# EAGLE design cm3-adaptor-board (EAGLE 9.5.2)
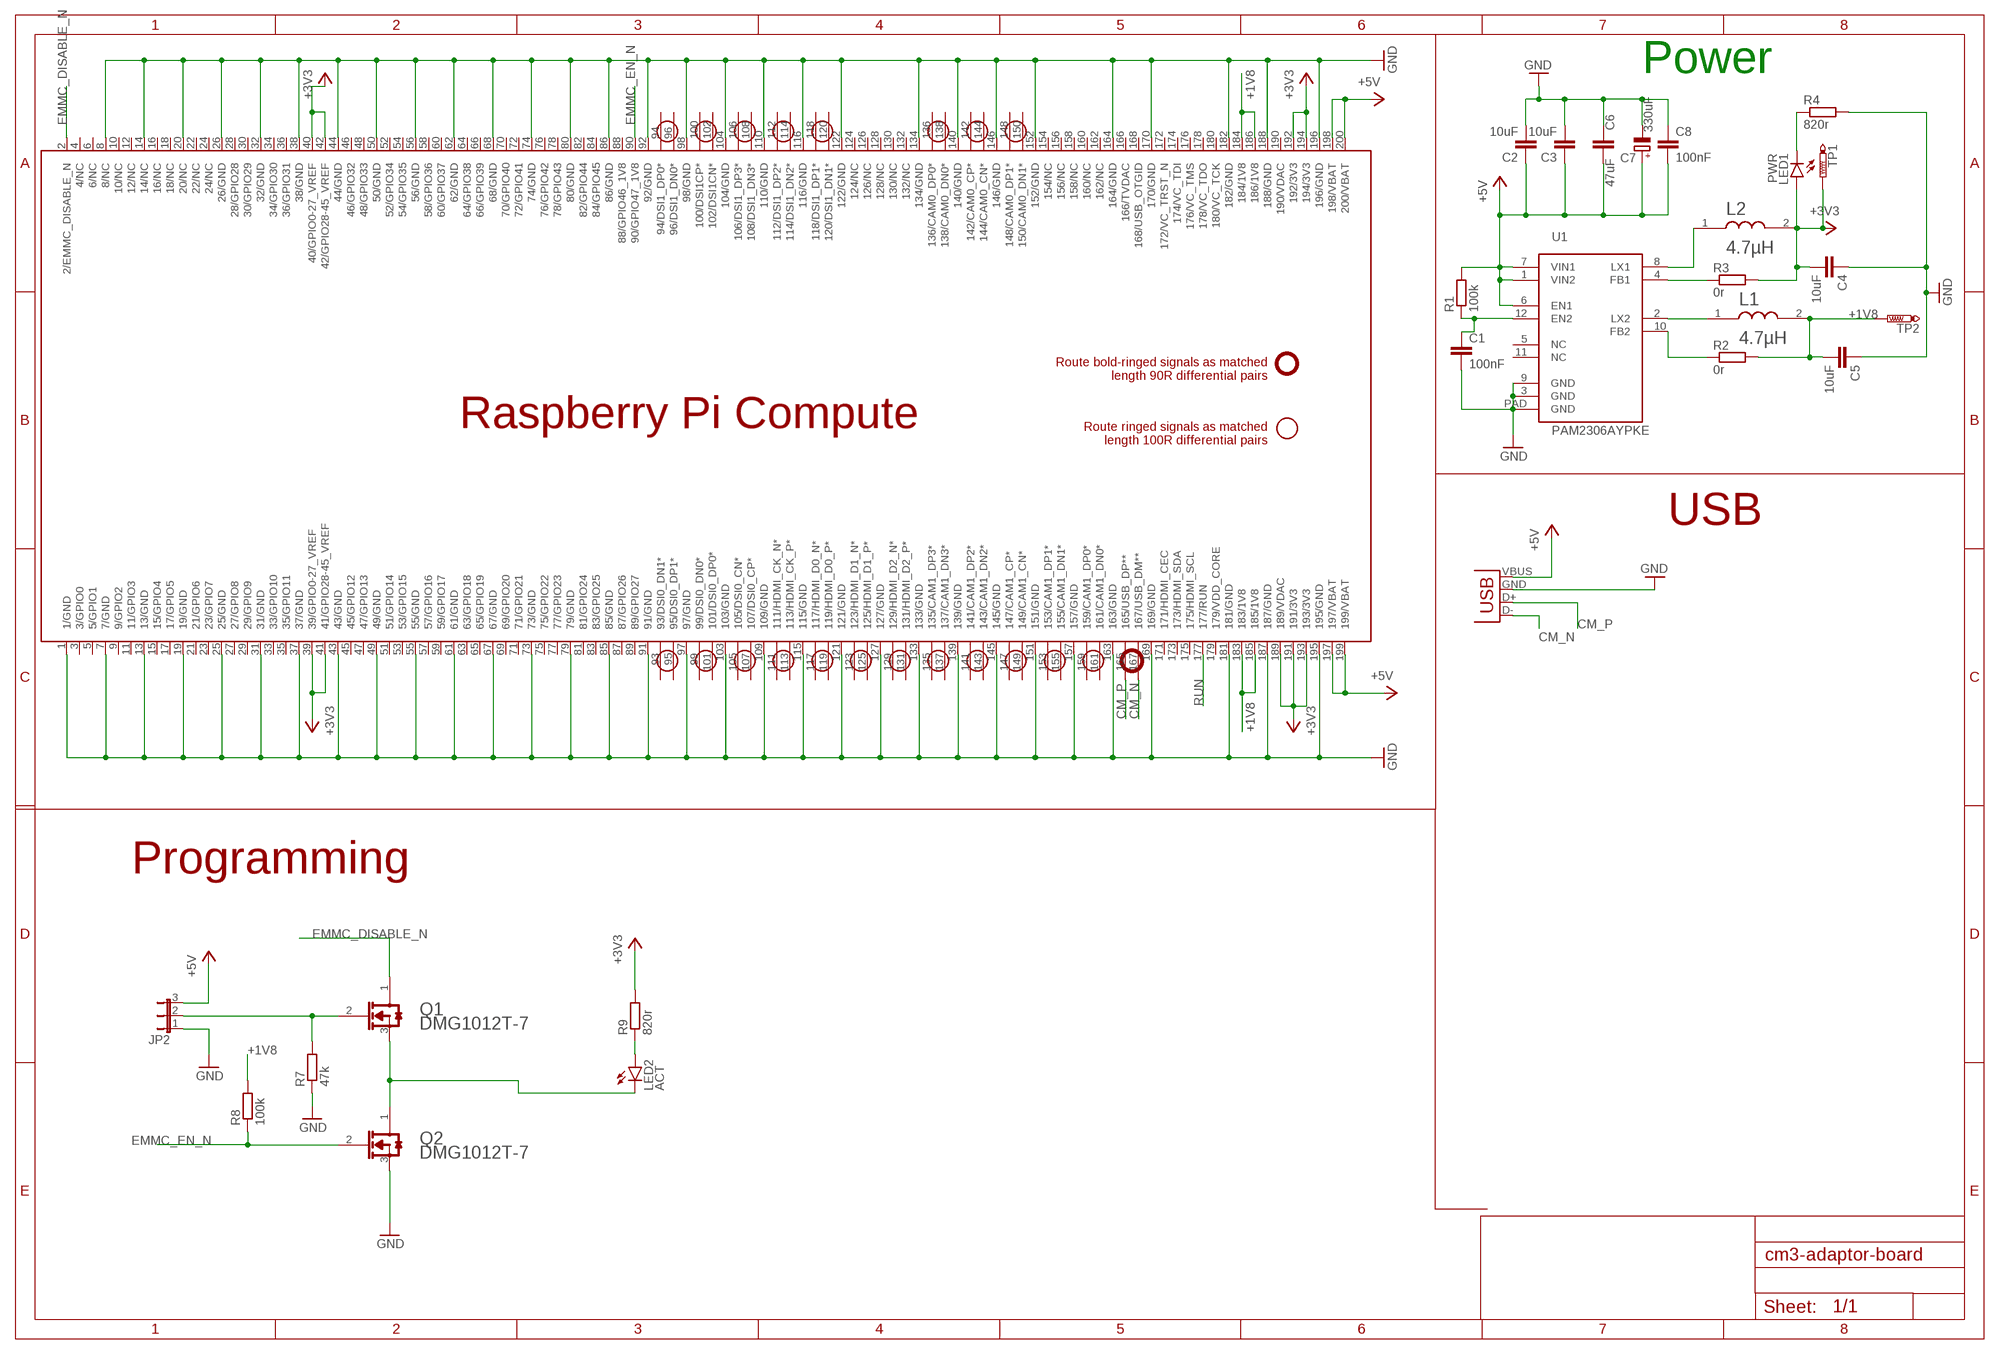
[diagram p0: schematic, sheet 1]

## Parts
C1  100nF  C-EUC0603  [C0603]
C2  10uF  C-EUC0805  [C0805]
C3  10uF  C-EUC0805  [C0805]
C4  10uF  C-EUC0805  [C0805]
C5  10uF  C-EUC0805  [C0805]
C6  47uF  C-EUC1206  [C1206]
C7  330uF  CPOL-EUD  [PANASONIC_D]
C8  100nF  C-EUC0603  [C0603]
JP1  USB-A-H  [USB-A-H]
JP2  JP2E  [JP2]
L1  BOURNS_SRN4018-4R7MBOURNS_SRN4018-4R7M_0_0  [BOURNS_SRN4018-4R7M_0]
L2  BOURNS_SRN4018-4R7MBOURNS_SRN4018-4R7M_0_0  [BOURNS_SRN4018-4R7M_0]
LED1  PWR  LEDCHIP-LED0603  [CHIP-LED0603]
LED2  ACT  LEDCHIP-LED0603  [CHIP-LED0603]
PCB1  RPI_COMPUTE  [RPI_COMPUTE]
Q1  DIODES_DMG1012T-7DIODES_DMG1012T-7_0_0  [DIODES_DMG1012T-7_0]
Q2  DIODES_DMG1012T-7DIODES_DMG1012T-7_0_0  [DIODES_DMG1012T-7_0]
R1  100k  R-EU_R0603  [R0603]
R2  0r  R-EU_R0603  [R0603]
R3  0r  R-EU_R0603  [R0603]
R4  820r  R-EU_R0603  [R0603]
R7  47k  R-EU_R0603  [R0603]
R8  100k  R-EU_R0603  [R0603]
R9  820r  R-EU_R0603  [R0603]
TP1  PTR1B1,27  [B1,27]
TP2  PTR1B1,27  [B1,27]
U1  PAM2306AYPKE  [WDFN-12L]

## Nets
+1V8: C5.2 L1.2 PCB1.183(183/1V8) PCB1.184(184/1V8) PCB1.185(185/1V8) PCB1.186(186/1V8) R2.2 R8.2 TP2.TP
+3V3: C4.2 L2.2 LED1.A PCB1.39(39/GPIO0-27_VREF) PCB1.40(40/GPIO0-27_VREF) PCB1.41(41/GPIO28-45_VREF) PCB1.42(42/GPIO28-45_VREF) PCB1.189(189/VDAC) PCB1.191(191/3V3) PCB1.192(192/3V3) PCB1.193(193/3V3) PCB1.194(194/3V3) R3.2 R9.2 TP1.TP
+5V: C2.1 C3.1 C6.2 C7.+ C8.2 JP1.VBUS(GND) JP2.3 PCB1.197(197/VBAT) PCB1.198(198/VBAT) PCB1.199(199/VBAT) PCB1.200(200/VBAT) R1.2 U1.1(VIN2) U1.6(EN1) U1.7(VIN1)
CM_N [usb_diff]: JP1.D-(D+) PCB1.167(167/USB_DM**)
CM_P [usb_diff]: JP1.D+(D-) PCB1.165(165/USB_DP**)
EMMC_DISABLE_N: PCB1.2(2/EMMC_DISABLE_N) Q1.1(DRAIN)
EMMC_EN_N: PCB1.90(90/GPIO47_1V8) Q2.2(GATE) R8.1
GND: C1.2 C2.2 C3.2 C4.1 C5.1 C6.1 C7.- C8.1 JP1.GND(VBUS) JP2.1 PCB1.1(1/GND) PCB1.7(7/GND) PCB1.8(8/NC) PCB1.13(13/GND) PCB1.14(14/NC) PCB1.19(19/GND) PCB1.20(20/NC) PCB1.25(25/GND) PCB1.26(26/GND) PCB1.31(31/GND) PCB1.32(32/GND) PCB1.37(37/GND) PCB1.38(38/GND) PCB1.43(43/GND) PCB1.44(44/GND) PCB1.49(49/GND) PCB1.50(50/GND) PCB1.55(55/GND) PCB1.56(56/GND) PCB1.61(61/GND) PCB1.62(62/GND) PCB1.67(67/GND) PCB1.68(68/GND) PCB1.73(73/GND) PCB1.74(74/GND) PCB1.79(79/GND) PCB1.80(80/GND) PCB1.85(85/GND) PCB1.86(86/GND) PCB1.91(91/GND) PCB1.92(92/GND) PCB1.97(97/GND) PCB1.98(98/GND) PCB1.103(103/GND) PCB1.104(104/GND) PCB1.109(109/GND) PCB1.110(110/GND) PCB1.115(115/GND) PCB1.116(116/GND) PCB1.121(121/GND) PCB1.122(122/GND) PCB1.127(127/GND) PCB1.133(133/GND) PCB1.134(134/GND) PCB1.139(139/GND) PCB1.140(140/GND) PCB1.145(145/GND) PCB1.146(146/GND) PCB1.151(151/GND) PCB1.152(152/GND) PCB1.157(157/GND) PCB1.163(163/GND) PCB1.164(164/GND) PCB1.169(169/GND) PCB1.170(170/GND) PCB1.181(181/GND) PCB1.182(182/GND) PCB1.187(187/GND) PCB1.188(188/GND) PCB1.195(195/GND) PCB1.196(196/GND) Q2.3(SOURCE) R4.2 R7.1 U1.3(GND) U1.9(GND) U1.PAD(GND)
N$1: C1.1 R1.1 U1.12(EN2)
N$2: L1.1 U1.2(LX2)
N$3: R2.1 U1.10(FB2)
N$4: R3.1 U1.4(FB1)
N$5: L2.1 U1.8(LX1)
N$9: LED1.C R4.1
N$11: JP2.2 Q1.2(GATE) R7.2
N$13: LED2.C Q1.3(SOURCE) Q2.1(DRAIN)
N$16: LED2.A R9.1
RUN: PCB1.177(177/RUN)
Unconnected: PCB1.3(3/GPIO0) PCB1.4(4/NC) PCB1.5(5/GPIO1) PCB1.6(6/NC) PCB1.9(9/GPIO2) PCB1.10(10/NC) PCB1.11(11/GPIO3) PCB1.12(12/NC) PCB1.15(15/GPIO4) PCB1.16(16/NC) PCB1.17(17/GPIO5) PCB1.18(18/NC) PCB1.21(21/GPIO6) PCB1.22(22/NC) PCB1.23(23/GPIO7) PCB1.24(24/NC) PCB1.27(27/GPIO8) PCB1.28(28/GPIO28) PCB1.29(29/GPIO9) PCB1.30(30/GPIO29) PCB1.33(33/GPIO10) PCB1.34(34/GPIO30) PCB1.35(35/GPIO11) PCB1.36(36/GPIO31) PCB1.45(45/GPIO12) PCB1.46(46/GPIO32) PCB1.47(47/GPIO13) PCB1.48(48/GPIO33) PCB1.51(51/GPIO14) PCB1.52(52/GPIO34) PCB1.53(53/GPIO15) PCB1.54(54/GPIO35) PCB1.57(57/GPIO16) PCB1.58(58/GPIO36) PCB1.59(59/GPIO17) PCB1.60(60/GPIO37) PCB1.63(63/GPIO18) PCB1.64(64/GPIO38) PCB1.65(65/GPIO19) PCB1.66(66/GPIO39) PCB1.69(69/GPIO20) PCB1.70(70/GPIO40) PCB1.71(71/GPIO21) PCB1.72(72/GPIO41) PCB1.75(75/GPIO22) PCB1.76(76/GPIO42) PCB1.77(77/GPIO23) PCB1.78(78/GPIO43) PCB1.81(81/GPIO24) PCB1.82(82/GPIO44) PCB1.83(83/GPIO25) PCB1.84(84/GPIO45) PCB1.87(87/GPIO26) PCB1.88(88/GPIO46_1V8) PCB1.89(89/GPIO27) PCB1.93(93/DSI0_DN1*) PCB1.94(94/DSI1_DP0*) PCB1.95(95/DSI0_DP1*) PCB1.96(96/DSI1_DN0*) PCB1.99(99/DSI0_DN0*) PCB1.100(100/DSI1CP*) PCB1.101(101/DSI0_DP0*) PCB1.102(102/DSI1CN*) PCB1.105(105/DSI0_CN*) PCB1.106(106/DSI1_DP3*) PCB1.107(107/DSI0_CP*) PCB1.108(108/DSI1_DN3*) PCB1.111(111/HDMI_CK_N*) PCB1.112(112/DSI1_DP2*) PCB1.113(113/HDMI_CK_P*) PCB1.114(114/DSI1_DN2*) PCB1.117(117/HDMI_D0_N*) PCB1.118(118/DSI1_DP1*) PCB1.119(119/HDMI_D0_P*) PCB1.120(120/DSI1_DN1*) PCB1.123(123/HDMI_D1_N*) PCB1.124(124/NC) PCB1.125(125/HDMI_D1_P*) PCB1.126(126/NC) PCB1.128(128/NC) PCB1.129(129/HDMI_D2_N*) PCB1.130(130/NC) PCB1.131(131/HDMI_D2_P*) PCB1.132(132/NC) PCB1.135(135/CAM1_DP3*) PCB1.136(136/CAM0_DP0*) PCB1.137(137/CAM1_DN3*) PCB1.138(138/CAM0_DN0*) PCB1.141(141/CAM1_DP2*) PCB1.142(142/CAM0_CP*) PCB1.143(143/CAM1_DN2*) PCB1.144(144/CAM0_CN*) PCB1.147(147/CAM1_CP*) PCB1.148(148/CAM0_DP1*) PCB1.149(149/CAM1_CN*) PCB1.150(150/CAM0_DN1*) PCB1.153(153/CAM1_DP1*) PCB1.154(154/NC) PCB1.155(155/CAM1_DN1*) PCB1.156(156/NC) PCB1.158(158/NC) PCB1.159(159/CAM1_DP0*) PCB1.160(160/NC) PCB1.161(161/CAM1_DN0*) PCB1.162(162/NC) PCB1.166(166/TVDAC) PCB1.168(168/USB_OTGID) PCB1.171(171/HDMI_CEC) PCB1.172(172/VC_TRST_N) PCB1.173(173/HDMI_SDA) PCB1.174(174/VC_TDI) PCB1.175(175/HDMI_SCL) PCB1.176(176/VC_TMS) PCB1.178(178/VC_TDO) PCB1.179(179/VDD_CORE) PCB1.180(180/VC_TCK) PCB1.190(190/VDAC) U1.5(NC) U1.11(NC)

## Notes on the sheet
- Power
- USB
- Programming

## Library data of the parts
C1-C6 C8 = resistor:C-EU: CAPACITOR, European symbol
C7 = resistor:CPOL-EU: POLARIZED CAPACITOR, European symbol
JP1 = decade:USB: USB Connectors USB-B-PTH is fully proven SKU : PRT-00139/CONN-08278 USB-miniB is fully proven SKU : PRT-00587 USB-A-PCB is untested. USB-A-H is throughly reviewed, but untested. Spark Fun Electronics SKU : PRT-00437 USB-B-SMT is throughly reviewed, but untested. Needs silkscreen touching up. USB-A-S has not been used/tested USB-MB-H has not been used/tested USB-MICROB has been used. CONN-09505
JP2 = jumper:JP2E: JUMPER
L1 L2 = Bourns - SRN4018-4R7M:BOURNS_SRN4018-4R7M: Fixed Inductors 4.7uH 20% SMD 4018; CENTROID_NOT_SPECIFIED: No; DATASHEET: http://www.bourns.com/docs/Product-Datasheets/SRN4018.pdf; DCR_MAX: 0.084 Ohm; DIGIKEY_DESCRIPTION: IND 4.7µH Shielded Wirewound Inductor 1.9A 84 mOhm Max Nonstandard; DIGIKEY_PART_NUMBER: SRN4018-4R7MCT-ND; IMPORTED_FROM: octopart; INDUCTANCE: 4.7µH; IRMS: 1.9A; ISAT: 2A; LEAD_FREE: yes; MF: Bourns; MOUSER_PART_NUMBER: 652-SRN4018-4R7M; MPN: SRN4018-4R7M; NUM_PINS: 2; OCTOPART_PART_NUMBER: ed5a25d49750329d; PACKAGE: IND_SMD_4MM0_4MM0; PREFIX: L; ROHS: yes; TEMPERATURE_RANGE_HIGH: +120°C; TEMPERATURE_RANGE_LOW: -25°C; TOL.: 20%
LED1 LED2 = led:LED: LED OSRAM: - CHIPLED LG R971, LG N971, LY N971, LG Q971, LY Q971, LO R971, LY R971 LH N974, LH R974 LS Q976, LO Q976, LY Q976 LO Q996 - Hyper CHIPLED LW Q18S LB Q993, LB Q99A, LB R99A - SideLED LS A670, LO A670, LY A670, LG A670, LP A670 LB A673, LV A673, LT A673, LW A673 LH A674 LY A675 LS A676, LA A676, LO A676, LY A676, LW A676 LS A679, LY A679, LG A679 - Hyper Micro SIDELED® LS Y876, LA Y876, LO Y876, LY Y876 LT Y87S - SmartLED LW L88C, LW L88S LB L89C, LB L89S, LG L890 LS L89K, LO L89K, LY L89K LS L896, LA L896, LO L896, LY L896 - TOPLED LS T670, LO T670, LY T670, LG T670, LP T670 LSG T670, LSP T670, LSY T670, LOP T670, LYG T670 LG T671, LOG T671, LSG T671 LB T673, LV T673, LT T673, LW T673 LH T674 LS T676, LA T676, LO T676, LY T676, LB T676, LH T676, LSB T676, LW T676 LB T67C, LV T67C, LT T67C, LS T67K, LO T67K, LY T67K, LW E67C LS E67B, LA E67B, LO E67B, LY E67B, LB E67C, LV E67C, LT E67C LW T67C LS T679, LY T679, LG T679 LS T770, LO T770, LY T770, LG T770, LP T770 LB T773, LV T773, LT T773, LW T773 LH T774 LS E675, LA E675, LY E675, LS T675 LS T776, LA T776, LO T776, LY T776, LB T776 LHGB T686 LT T68C, LB T68C - Hyper Mini TOPLED® LB M676 - Mini TOPLED Santana® LG M470 LS M47K, LO M47K, LY M47K Source: http://www.osram.convergy.de LUXEON: - LUMILED® LXK2-PW12-R00, LXK2-PW12-S00, LXK2-PW14-U00, LXK2-PW14-V00 LXK2-PM12-R00, LXK2-PM12-S00, LXK2-PM14-U00 LXK2-PE12-Q00, LXK2-PE12-R00, LXK2-PE12-S00, LXK2-PE14-T00, LXK2-PE14-U00 LXK2-PB12-K00, LXK2-PB12-L00, LXK2-PB12-M00, LXK2-PB14-N00, LXK2-PB14-P00, LXK2-PB14-Q00 LXK2-PR12-L00, LXK2-PR12-M00, LXK2-PR14-Q00, LXK2-PR14-R00 LXK2-PD12-Q00, LXK2-PD12-R00, LXK2-PD12-S00 LXK2-PH12-R00, LXK2-PH12-S00 LXK2-PL12-P00, LXK2-PL12-Q00, LXK2-PL12-R00 Source: www.luxeon.com KINGBRIGHT: KA-3528ASYC Source: www.kingbright.com
PCB1 = e14_Rpi_Compute_RevC:RPI_COMPUTE: Device for a Raspberry PI Compute module. Note that the package is for a DDR2 connector of 'standard' orientation. Example: TE Connectivity P/N: 1565917-4, Newark P/N: 08P0616, Farnell P/N: 2112525 More information is available at http://www.element14.com/community/community/raspberry-pi/raspberry-pi-compute-module
Q1 Q2 = Diodes - DMG1012T-7:DIODES_DMG1012T-7: N-CHANNEL ENHANCEMENT MODE MOSFET; CENTROID_NOT_SPECIFIED: No; DATASHEET: https://www.diodes.com/assets/Datasheets/ds31783.pdf; DIGIKEY_DESCRIPTION: TRANS MOSFET N-CH 20V 630MA SOT-523; DIGIKEY_PART_NUMBER: DMG1012T-7DICT-ND; LEAD_FREE: yes; MF: Diodes; MOUSER_PART_NUMBER: 621-DMG1012T-7; MPN: DMG1012T-7; PACKAGE: SOT523; PREFIX: Q; ROHS: yes; TEMPERATURE_RANGE_HIGH: +150°C; TEMPERATURE_RANGE_LOW: -55°C
R1-R4 R7-R9 = resistor:R-EU_: RESISTOR, European symbol
TP1 TP2 = testpad:PTR1: TEST PIN
U1 = pimoroni-ics:PAM2306AYPKE

## Net classes
1 usb_diff: width 0.127 mm, clearance 0.178 mm

## Board
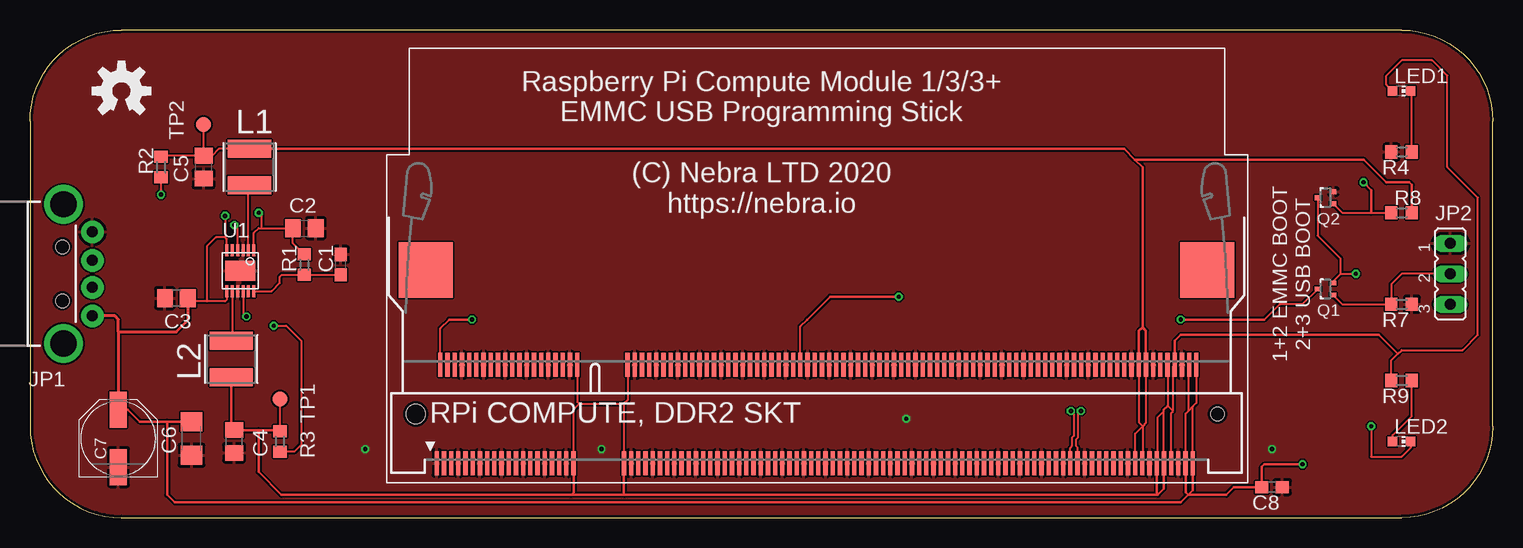
[diagram p1: board, top side]
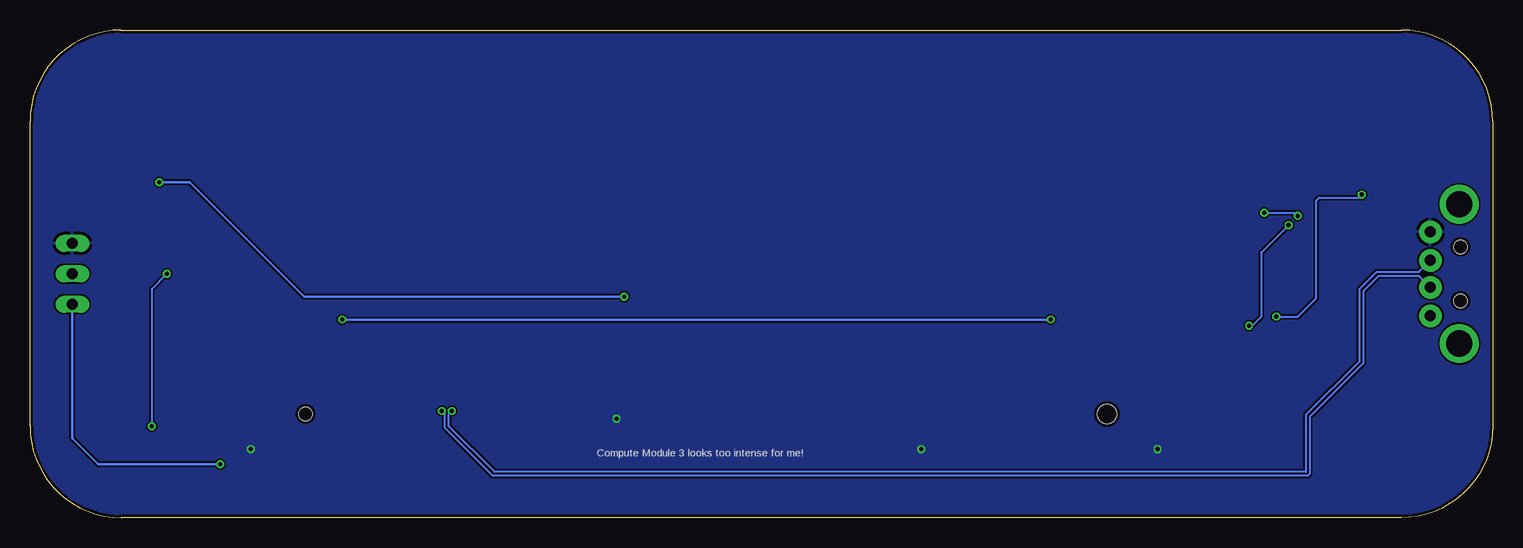
[diagram p2: board, bottom side, seen from below]

Size 121.9 x 40.64 mm. Coordinates in mm from the lower left corner, seen from the top.
Outline: 7.62,0 114.3,0 arc90 121.9,7.62 121.9,33.02 arc90 114.3,40.64 7.62,40.64 arc90 0,33.02 0,7.62 arc90 7.62,0
Copper layers (1*16): Top 0.035mm / dielectric 1.5mm / Bottom 0.035mm
Design rules "dirt_cheap_dirty_boards.v1.1": minimum track width 6mil, minimum drill 12mil, track to track 6mil, track to pad 6mil, pad to pad 6mil, via to via 6mil, smd to smd 0mil, copper to edge 10mil, drill to drill 10mil, minimum pad ring 10mil, minimum via ring 6mil, stop-mask expansion 2mil, vias tented up to drill 25mil, thermal gap 10mil

### Footprints (pad centres in the part's own frame; a part is rotated, then mirrored left to right if it is on the bottom)
C0603 = smd 1.1 x 1: 1 -0.85,0; 2 0.85,0
C0805 = smd 1.3 x 1.5: 1 -0.95,0; 2 0.95,0
C1206 = smd 1.6 x 1.8: 1 -1.4,0; 2 1.4,0
PANASONIC_D = smd 3 x 1.4: + 2.4,0; - -2.4,0
USB-A-H = drill 0.914 pad 1.88: D+ 2.4,1.127; D- 2.4,-1.127; GND 2.4,3.5; VBUS 2.4,-3.5 | drill 2.2: GND2 0,-5.8; GND3 0,5.8 | hole 1.1: -0.1,2.25; -0.1,-2.25
JP2 = drill 0.914 long: 1 -2.54,0; 2 0,0; 3 2.54,0
BOURNS_SRN4018-4R7M_0 = smd 1.5 x 3.6: 1 -1.525,0; 2 1.525,0
CHIP-LED0603 = smd 0.8 x 0.8: A 0,-0.75; C 0,0.75
RPI_COMPUTE = smd 0.35 x 2: 1 -31.38,-4.1; 2 -31.08,4.1; 3 -30.78,-4.1; 4 -30.48,4.1; 5 -30.18,-4.1; 6 -29.88,4.1; 7 -29.58,-4.1; 8 -29.28,4.1; 9 -28.98,-4.1; 10 -28.68,4.1; 11 -28.38,-4.1; 12 -28.08,4.1; 13 -27.78,-4.1; 14 -27.48,4.1; 15 -27.18,-4.1; 16 -26.88,4.1; 17 -26.58,-4.1; 18 -26.28,4.1; 19 -25.98,-4.1; 20 -25.68,4.1; 21 -25.38,-4.1; 22 -25.08,4.1; 23 -24.78,-4.1; 24 -24.48,4.1; 25 -24.18,-4.1; 26 -23.88,4.1; 27 -23.58,-4.1; 28 -23.28,4.1; 29 -22.98,-4.1; 30 -22.68,4.1; 31 -22.38,-4.1; 32 -22.08,4.1; 33 -21.78,-4.1; 34 -21.48,4.1; 35 -21.18,-4.1; 36 -20.88,4.1; 37 -20.58,-4.1; 38 -20.28,4.1; 39 -19.98,-4.1; 40 -19.68,4.1; 41 -15.78,-4.1; 42 -15.48,4.1; 43 -15.18,-4.1; 44 -14.88,4.1; 45 -14.58,-4.1; 46 -14.28,4.1; 47 -13.98,-4.1; 48 -13.68,4.1; 49 -13.38,-4.1; 50 -13.08,4.1; 51 -12.78,-4.1; 52 -12.48,4.1; 53 -12.18,-4.1; 54 -11.88,4.1; 55 -11.58,-4.1; 56 -11.28,4.1; 57 -10.98,-4.1; 58 -10.68,4.1; 59 -10.38,-4.1; 60 -10.08,4.1; 61 -9.78,-4.1; 62 -9.48,4.1; 63 -9.18,-4.1; 64 -8.88,4.1; 65 -8.58,-4.1; 66 -8.28,4.1; 67 -7.98,-4.1; 68 -7.68,4.1; 69 -7.38,-4.1; 70 -7.08,4.1; 71 -6.78,-4.1; 72 -6.48,4.1; 73 -6.18,-4.1; 74 -5.88,4.1; 75 -5.58,-4.1; 76 -5.28,4.1; 77 -4.98,-4.1; 78 -4.68,4.1; 79 -4.38,-4.1; 80 -4.08,4.1; 81 -3.78,-4.1; 82 -3.48,4.1; 83 -3.18,-4.1; 84 -2.88,4.1; 85 -2.58,-4.1; 86 -2.28,4.1; 87 -1.98,-4.1; 88 -1.68,4.1; 89 -1.38,-4.1; 90 -1.08,4.1; 91 -0.78,-4.1; 92 -0.48,4.1; 93 -0.18,-4.1; 94 0.12,4.1; 95 0.42,-4.1; 96 0.72,4.1; 97 1.02,-4.1; 98 1.32,4.1; 99 1.62,-4.1; 100 1.92,4.1; 101 2.22,-4.1; 102 2.52,4.1; 103 2.82,-4.1; 104 3.12,4.1; 105 3.42,-4.1; 106 3.72,4.1; 107 4.02,-4.1; 108 4.32,4.1; 109 4.62,-4.1; 110 4.92,4.1; 111 5.22,-4.1; 112 5.52,4.1; 113 5.82,-4.1; 114 6.12,4.1; 115 6.42,-4.1; 116 6.72,4.1; 117 7.02,-4.1; 118 7.32,4.1; 119 7.62,-4.1; 120 7.92,4.1; 121 8.22,-4.1; 122 8.52,4.1; 123 8.82,-4.1; 124 9.12,4.1; 125 9.42,-4.1; 126 9.72,4.1; 127 10.02,-4.1; 128 10.32,4.1; 129 10.62,-4.1; 130 10.92,4.1; 131 11.22,-4.1; 132 11.52,4.1; 133 11.82,-4.1; 134 12.12,4.1; 135 12.42,-4.1; 136 12.72,4.1; 137 13.02,-4.1; 138 13.32,4.1; 139 13.62,-4.1; 140 13.92,4.1; 141 14.22,-4.1; 142 14.52,4.1; 143 14.82,-4.1; 144 15.12,4.1; 145 15.42,-4.1; 146 15.72,4.1; 147 16.02,-4.1; 148 16.32,4.1; 149 16.62,-4.1; 150 16.92,4.1; 151 17.22,-4.1; 152 17.52,4.1; 153 17.82,-4.1; 154 18.12,4.1; 155 18.42,-4.1; 156 18.72,4.1; 157 19.02,-4.1; 158 19.32,4.1; 159 19.62,-4.1; 160 19.92,4.1; 161 20.22,-4.1; 162 20.52,4.1; 163 20.82,-4.1; 164 21.12,4.1; 165 21.42,-4.1; 166 21.72,4.1; 167 22.02,-4.1; 168 22.32,4.1; 169 22.62,-4.1; 170 22.92,4.1; 171 23.22,-4.1; 172 23.52,4.1; 173 23.82,-4.1; 174 24.12,4.1; 175 24.42,-4.1; 176 24.72,4.1; 177 25.02,-4.1; 178 25.32,4.1; 179 25.62,-4.1; 180 25.92,4.1; 181 26.22,-4.1; 182 26.52,4.1; 183 26.82,-4.1; 184 27.12,4.1; 185 27.42,-4.1; 186 27.72,4.1; 187 28.02,-4.1; 188 28.32,4.1; 189 28.62,-4.1; 190 28.92,4.1; 191 29.22,-4.1; 192 29.52,4.1; 193 29.82,-4.1; 194 30.12,4.1; 195 30.42,-4.1; 196 30.72,4.1; 197 31.02,-4.1; 198 31.32,4.1; 199 31.62,-4.1; 200 31.92,4.1 | smd 4.5 x 4.6: M1 -32.28,12; M2 32.82,12 | hole 1.6: -33.13,0 | hole 1.1: 33.67,0
DIODES_DMG1012T-7_0 = smd 0.4 x 0.51: 1 0,0.65; 2 -0.5,-0.65; 3 0.5,-0.65
R0603 = smd 1 x 1.1: 1 -0.85,0; 2 0.85,0
B1,27 = smd 1.27 x 1.27: TP 0,0
WDFN-12L = smd 1 x 0.25: 1 -1.7,1.125; 2 -1.7,0.675; 3 -1.7,0.225; 4 -1.7,-0.225; 5 -1.7,-0.675; 6 -1.7,-1.125; 7 1.7,-1.125; 8 1.7,-0.675; 9 1.7,-0.225; 10 1.7,0.225; 11 1.7,0.675; 12 1.7,1.125 | smd 1.7 x 2.5: PAD 0,0

### Placement (x,y rotation side)
C1  25.91,21.08 90 top
C2  22.86,24.13 0 top
C3  12.19,18.29 180 top
C4  17.02,6.35 90 top
C5  14.48,29.21 90 top
C6  13.46,6.6 90 top
C7  7.37,6.6 90 top
C8  103.5,2.54 180 top
JP1  2.79,20.32 0 top
JP2  118.36,20.32 270 top
L1  18.29,29.21 90 top
L2  16.76,13.21 270 top
LED1  114.3,35.56 270 top
LED2  114.3,6.35 270 top
PCB1  65.28,8.64 0 top
Q1  107.95,19.05 90 top
Q2  107.95,26.67 90 top
R1  22.86,21.08 90 top
R2  10.92,29.21 90 top
R3  20.83,6.35 90 top
R4  114.3,30.48 180 top
R7  114.3,17.78 180 top
R8  114.3,25.4 0 top
R9  114.3,11.43 180 top
TP1  20.83,9.91 270 top
TP2  14.48,32.77 90 top
U1  17.53,20.57 270 top
U$1  [OSHW-LOGO-M]  7.62,35.56 0 top

### Tracks (layer width: path | path; a pad name or v marks a point on that pad's centre or on a via)
+1V8
  Top 0.152: L1.2 15.75,30.73 15.17,30.16 C5.2 | C5.2 11.02,30.16 R2.2 | C5.2 TP2.TP | PCB1.185 92.71,7.62 | PCB1.183 92.1,7.01 92.71,7.62 | PCB1.186 93,7.91 92.71,7.62 | PCB1.184 92.4,7.93 92.71,7.62
  Top 0.203: L1.2 91.19,30.73 92.08,29.84 | 92.08,29.84 92.71,29.21 92.71,15.88 | PCB1.186 93,15.59 92.71,15.88 | PCB1.184 92.4,15.56 92.71,15.88 | R8.2 115.15,27.73 114.94,27.94 113.03,27.94 111.12,29.84 92.08,29.84
+3V3
  Top 0.152: 16.76,7.55 C4.2 17.12,7.2 | TP1.TP R3.2 | R9.2 113.45,13.12 113.98,13.65 114.3,13.97 119.38,13.97 120.65,15.24 120.65,26.67 118.11,29.21 118.11,36.83 116.84,38.1 114.3,38.1 113.03,36.83 113.03,36.08 LED1.A | PCB1.194 95.25,12.59 95.25,8.89 | PCB1.192 94.8,9.34 | 94.8,9.34 95.25,8.89 | PCB1.193 95.1,8.74 95.25,8.89 | PCB1.191 94.5,8.89 | 94.5,8.89 94.5,9.04 94.8,9.34 | PCB1.189 93.98,4.62 93.98,8.37 94.5,8.89 | 49.5,9.49 PCB1.41 | PCB1.42 49.8,9.79 49.5,9.49 | PCB1.40 45.6,9.65 45.75,9.49 | 45.75,9.49 49.5,9.49 | PCB1.39 45.3,9.04 45.75,9.49
  Top 0.203: L2.2 16.76,7.55 17.12,7.2 | C4.2 19.05,7.3 | 19.05,7.3 20.73,7.3 R3.2 | 19.05,7.3 19.05,3.81 20.95,1.91 45.09,1.91 | 93.98,1.91 49.53,1.91 | 49.53,1.91 45.09,1.91 | PCB1.191 94.5,2.42 93.98,1.91 | PCB1.39 45.3,2.12 45.09,1.91 | PCB1.41 49.5,1.94 49.53,1.91 | PCB1.189 93.9,1.99 93.98,1.91 | PCB1.194 95.4,14.75 95.89,15.24 112.39,15.24 113.98,13.65
+5V  (via drill 0.35)
  Top 0.152: U1.1 18.65,23.73 19.05,24.13 19.3,24.13 | 19.3,24.13 C2.1 21.91,22.88 R1.2 | U1.7 16.4,18.18 16.26,18.03 14.73,18.03 | 14.73,18.03 13.4,18.03 13.18,18.25 C3.1 | U1.6 16.4,23.22 16.26,23.37 | 16.26,23.37 15.49,23.37 14.73,22.61 14.73,18.03 | 19.3,24.13 19.3,25.15 v19.05,25.4 | v16.26,25.15 16.26,23.37 | PCB1.200 97.2,9.57 96.9,9.27 | PCB1.199 96.9,9.27 | PCB1.197 96.3,8.67 96.52,8.89 | 96.52,8.89 96.9,9.27 | PCB1.198 96.52,12.66 96.52,8.89
  Top 0.203: C7.+ 8.14,9 9.14,8 11.43,8 | 11.43,8 C6.2 | 11.43,8 11.43,1.91 12.06,1.27 95.89,1.27 96.52,1.91 | PCB1.197 96.3,2.13 96.52,1.91 | PCB1.199 96.9,2.28 96.52,1.91 | 96.52,1.91 99.69,1.91 100.33,2.54 C8.2 102.66,4.23 102.87,4.45 v106.05,4.45
  Top 0.254: 7.37,15.49 C7.+ | 7.37,15.49 12.19,15.49 13.18,16.48 13.18,18.25 | JP1.VBUS 7.06,16.82 7.37,16.51 7.37,15.49
  Bottom 0.152: v16.26,25.15 16.51,25.4 v19.05,25.4
  Bottom 0.203: v106.05,4.45 116.2,4.45 118.36,6.6 JP2.3
CM_N  (via drill 0.35)
  Top 0.152: v87.58,8.89 87.33,8.64 87.33,6.67 87.16,6.51 87.16,5.98 87.3,5.84 PCB1.167
  Bottom 0.152: v87.58,8.89 87.33,8.64 87.33,7.48 83.32,3.48 15.43,3.48 15.24,3.67 15.24,8.42 10.79,12.87 10.79,18.89 9.53,20.16 6.16,20.16 JP1.D-
CM_P  (via drill 0.35)
  Top 0.152: v86.74,8.89 87,8.64 87,6.81 86.83,6.65 86.83,5.98 86.7,5.84 PCB1.165
  Bottom 0.152: v86.74,8.89 87,8.64 87,7.62 83.19,3.81 15.57,3.81 15.57,8.56 11.12,13.01 11.12,19.02 9.66,20.48 6.16,20.48 JP1.D+
EMMC_DISABLE_N  (via drill 0.35)
  Top 0.152: Q1.1 106.03,17.78 104.14,17.78 | PCB1.2 34.2,15.78 34.92,16.51
  Top 0.203: 104.14,17.78 102.87,16.51 v95.89,16.51 | v36.83,16.51 34.92,16.51
  Bottom 0.203: v95.89,16.51 v36.83,16.51
EMMC_EN_N  (via drill 0.35)
  Top 0.152: Q2.2 109.37,25.4 111.76,25.4 R8.1 | PCB1.90 64.2,15.94 64.77,16.51
  Top 0.203: 64.77,16.51 66.67,18.41 v72.39,18.41 | v111.12,27.94 111.76,27.3 111.76,25.4
  Bottom 0.203: v111.12,27.94 108.58,27.94 99.06,18.41 v72.39,18.41
GND  (via drill 0.35)
  other vias: 47.62,5.71 73.03,8.26 103.5,5.71 27.94,5.71
  pour Top: -10.16,-6.35 -10.16,109.22 -5.08,114.3 156.21,114.3 163.83,106.68 163.83,1.27 154.94,-7.62 -8.89,-7.62
  pour Bottom: -8.89,-6.35 -8.89,109.22 -3.81,114.3 157.48,114.3 165.1,106.68 165.1,1.27 156.21,-7.62 -7.62,-7.62
N$1
  Top 0.152: U1.12 20.14,18.87 20.83,19.56 20.83,20.07 20.99,20.23 R1.1 C1.1
N$2
  Top 0.152: U1.2 18.2,27.6 L1.1
N$3  (via drill 0.35)
  Top 0.152: U1.10 17.78,18.84 17.78,17.02 v18.03,16.76 | v10.92,26.92 R2.1
  Bottom 0.152: v18.03,16.76 16.26,16.76 14.73,18.29 14.73,26.42 14.48,26.67 11.18,26.67 v10.92,26.92
N$4  (via drill 0.35)
  Top 0.152: U1.4 17.3,24.1 v17.02,24.38 | v20.32,16 21.34,16 22.61,14.73 22.61,6.1 22.01,5.5 R3.1
  Bottom 0.152: v17.02,24.38 19.3,22.1 19.3,16.76 20.07,16 v20.32,16
N$5
  Top 0.152: U1.8 16.85,14.82 L2.1
N$9
  Top 0.152: R4.1 115.15,35.46 LED1.C
N$11
  Top 0.152: Q1.2 109.37,17.78 R7.2 113.45,19.47 114.3,20.32 JP2.2
N$13  (via drill 0.35)
  Top 0.152: LED2.C 115.05,5.83 114.3,5.08 111.76,5.08 v111.76,7.62 | Q2.1 107.3,23.51 109.22,21.59 109.22,20.32 | Q1.3 108.6,19.7 109.22,20.32 | 109.22,20.32 v110.49,20.32
  Bottom 0.152: v110.49,20.32 111.76,19.05 v111.76,7.62
N$16
  Top 0.152: LED2.A 113.55,6.87 115.15,8.47 R9.1

### Text on the board
tNames: Raspberry Pi Compute Module 1/3/3+ / EMMC USB Programming Stick | (C) Nebra LTD 2020 | https://nebra.io | 1+2 EMMC BOOT / 2+3 USB BOOT
bNames: Compute Module 3 looks too intense for me!